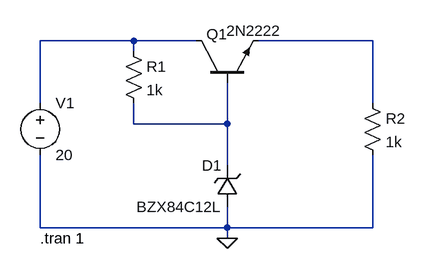
[diagram p0: schematic 3EEC_VELASCO_EXPT9_CKT1.asc]
3EEC_VELASCO_EXPT9_CKT1.asc, the LTspice schematic file:
Version 4
SHEET 1 880 680
WIRE 80 48 -64 48
WIRE 176 48 80 48
WIRE 448 48 272 48
WIRE 80 64 80 48
WIRE -64 144 -64 48
WIRE 448 144 448 48
WIRE 80 176 80 144
WIRE 224 176 224 112
WIRE 224 176 80 176
WIRE 224 240 224 176
WIRE -64 336 -64 224
WIRE 224 336 224 304
WIRE 224 336 -64 336
WIRE 448 336 448 224
WIRE 448 336 224 336
WIRE 224 352 224 336
FLAG 224 352 0
SYMBOL zener 240 304 R180
WINDOW 0 24 64 Left 2
WINDOW 3 24 0 Left 2
SYMATTR InstName D1
SYMATTR Value BZX84C12L
SYMBOL npn 176 112 R270
WINDOW 0 59 32 VTop 2
WINDOW 3 95 89 VBottom 2
SYMATTR InstName Q1
SYMATTR Value 2N2222
SYMBOL res 64 48 R0
SYMATTR InstName R1
SYMATTR Value 1k
SYMBOL voltage -64 128 R0
SYMATTR InstName V1
SYMATTR Value 20
SYMBOL res 432 128 R0
SYMATTR InstName R2
SYMATTR Value 1k
TEXT -64 352 Left 2 !.tran 1

The netlist it stands for:
* 3EEC_VELASCO_EXPT9_CKT1.asc
D1 0 N003 BZX84C12L
Q1 N001 N003 N002 0 2N2222
R1 N001 N003 1k
V1 N001 0 20
R2 N002 0 1k
.model D D
.lib standard.dio
.model NPN NPN
.model PNP PNP
.lib standard.bjt
.tran 1
.backanno
.end